# EAGLE schematic AS3364 waveform VCA 0402 DIL w two separate vcas v1.0 (EAGLE 9.6.2)
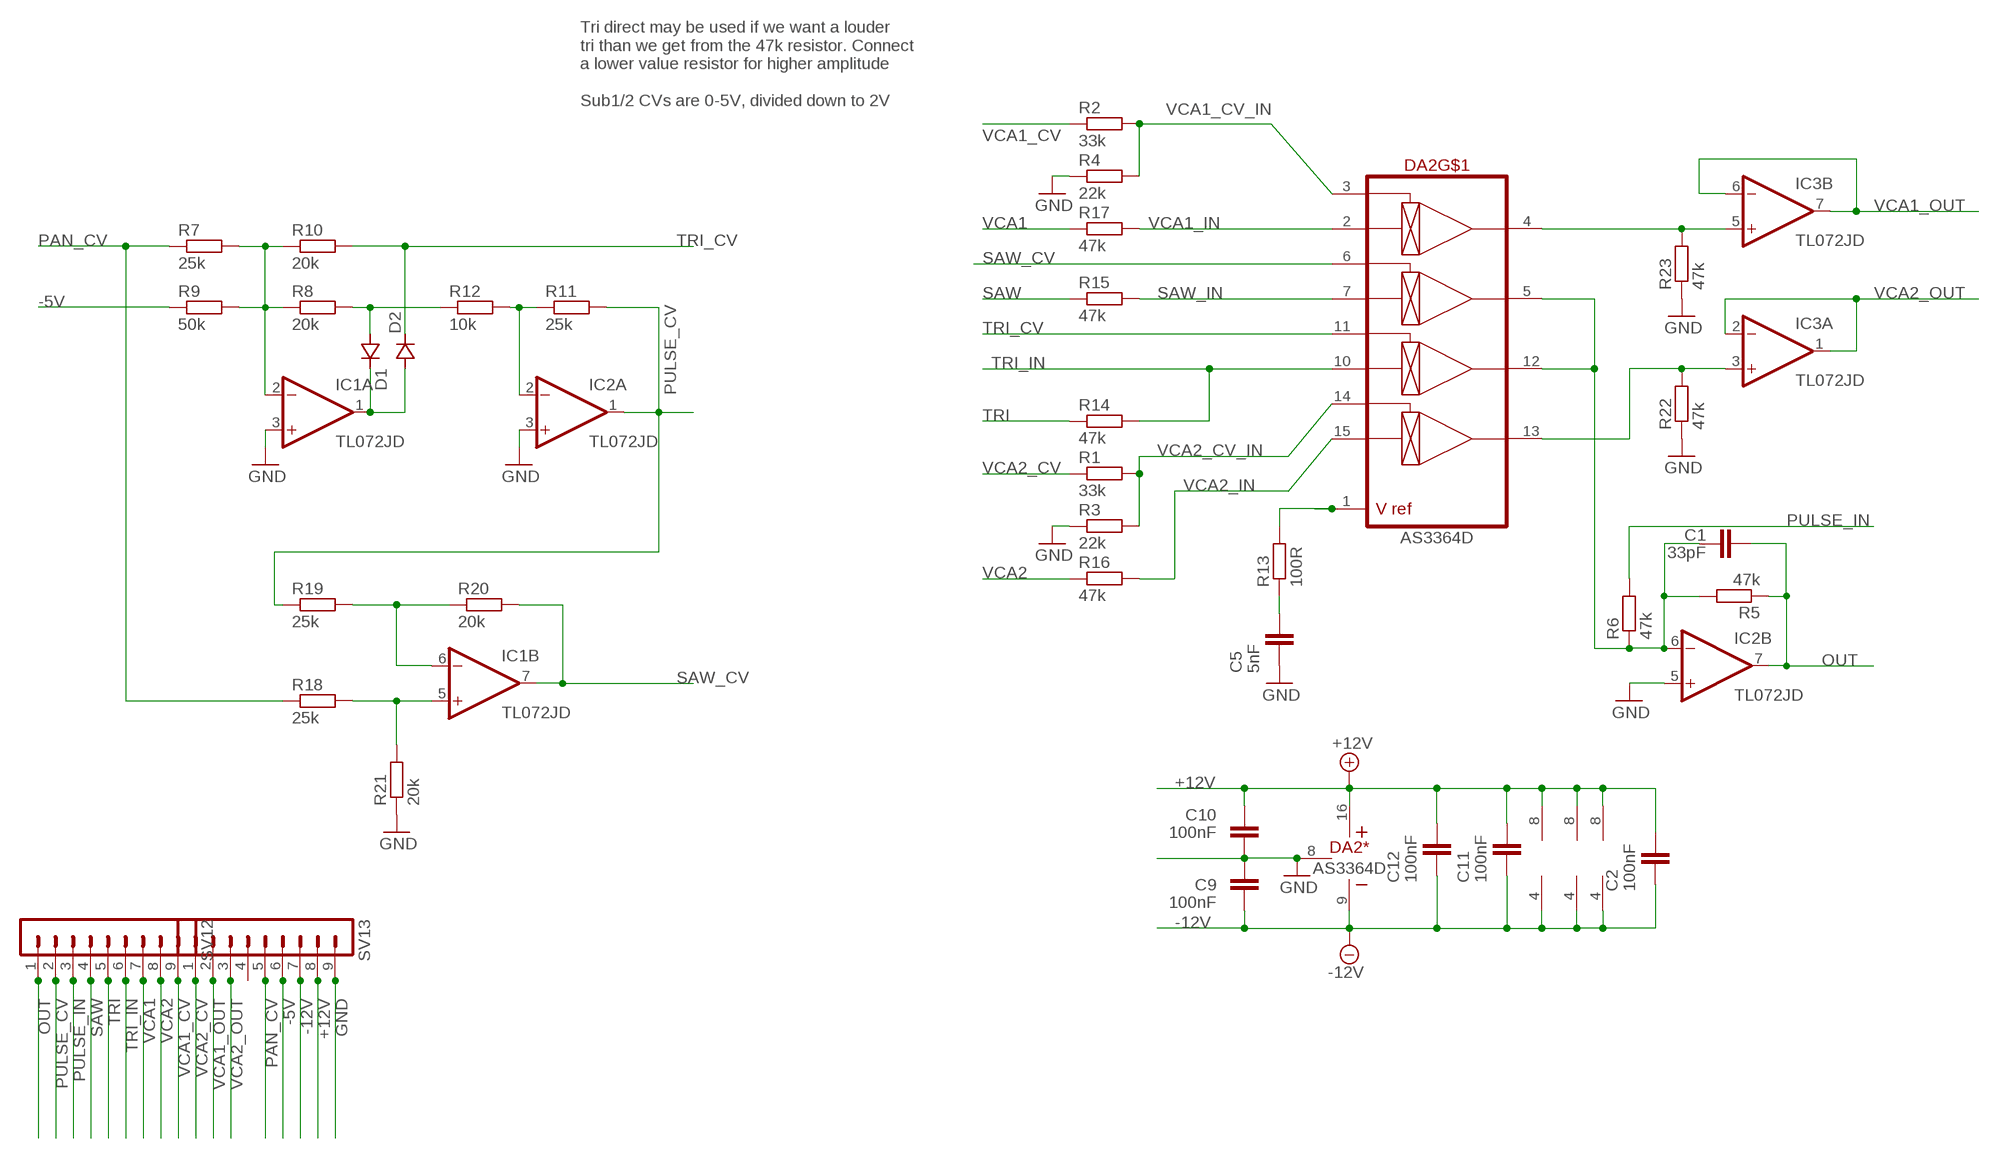
[diagram p0: schematic, sheet 1]

## Parts
C1  33pF  C-EUC0402  [C0402]
C2  100nF  C-EUC0402  [C0402]
C5  5nF  C-EUC0402  [C0402]
C9  100nF  C-EUC0402  [C0402]
C10  100nF  C-EUC0402  [C0402]
C11  100nF  C-EUC0402  [C0402]
C12  100nF  C-EUC0402  [C0402]
D1  DIODESOD323  [SOD323J]
D2  DIODESOD323  [SOD323J]
DA2  AS3364D  [DIL16J]
IC1  TL072JD  [SO08J]
IC2  TL072JD  [SO08J]
IC3  TL072JD  [SO08J]
R1  33k  R-EU_R0402  [R0402]
R2  33k  R-EU_R0402  [R0402]
R3  22k  R-EU_R0402  [R0402]
R4  22k  R-EU_R0402  [R0402]
R5  47k  R-EU_R0402  [R0402]
R6  47k  R-EU_R0402  [R0402]
R7  25k  R-EU_R0402  [R0402]
R8  20k  R-EU_R0402  [R0402]
R9  50k  R-EU_R0402  [R0402]
R10  20k  R-EU_R0402  [R0402]
R11  25k  R-EU_R0402  [R0402]
R12  10k  R-EU_R0402  [R0402]
R13  100R  R-EU_R0402  [R0402]
R14  47k  R-EU_R0402  [R0402]
R15  47k  R-EU_R0402  [R0402]
R16  47k  R-EU_R0402  [R0402]
R17  47k  R-EU_R0402  [R0402]
R18  25k  R-EU_R0402  [R0402]
R19  25k  R-EU_R0402  [R0402]
R20  20k  R-EU_R0402  [R0402]
R21  20k  R-EU_R0402  [R0402]
R22  47k  R-EU_R0402  [R0402]
R23  47k  R-EU_R0402  [R0402]
SV12  MA09-1JP  [SIP-PIN09-1J]
SV13  MA09-1JP  [SIP-PIN09-1J]

## Nets
+12V: C2.2 C10.2 C11.2 C12.2 DA2.16(*:V+) IC1.8(P:V+) IC2.8(P:V+) IC3.8(P:V+) SV13.8
-5V: R9.1 SV13.6
-12V: C2.1 C9.1 C11.1 C12.1 DA2.9(*:V-) IC1.4(P:V-) IC2.4(P:V-) IC3.4(P:V-) SV13.7
GND: C5.1 C9.2 C10.1 DA2.8(*:GND) IC1.3(A:+IN) IC2.3(A:+IN) IC2.5(B:+IN) R3.1 R4.1 R21.1 R22.1 R23.1 SV13.9
MIX_BUS: C1.2 DA2.5(OUT2) DA2.12(OUT3) IC2.6(B:-IN) R5.2 R6.1
N$2: DA2.1(VREF) R13.2
N$3: DA2.4(OUT1) IC3.5(B:+IN) R23.2
N$6: D1.1(C) D2.2(A) IC1.1(A:OUT)
N$7: DA2.13(OUT4) IC3.3(A:+IN) R22.2
N$8: IC1.2(A:-IN) R7.2 R8.1 R9.2 R10.1
N$11: IC1.5(B:+IN) R18.2 R21.2
N$14: C5.2 R13.1
N$15: IC1.6(B:-IN) R19.2 R20.1
N$18: IC2.2(A:-IN) R11.1 R12.2
N$19: D1.2(A) R8.2 R12.1
OUT: C1.1 IC2.7(B:OUT) R5.1 SV12.1
PAN_CV: R7.1 R18.1 SV13.5
PULSE_CV: IC2.1(A:OUT) R11.2 R19.1 SV12.2
PULSE_IN: R6.2 SV12.3
SAW: R15.1 SV12.4
SAW_CV: DA2.6(CV2) IC1.7(B:OUT) R20.2
SAW_IN: DA2.7(IN2) R15.2
TRI: R14.1 SV12.5
TRI_CV: D2.1(C) DA2.11(CV3) R10.2
TRI_IN: DA2.10(IN3) R14.2 SV12.6
VCA1: R17.1 SV12.7
VCA1_CV: R2.1 SV12.9
VCA1_CV_IN: DA2.3(CV1) R2.2 R4.2
VCA1_IN: DA2.2(IN1) R17.2
VCA1_OUT: IC3.6(B:-IN) IC3.7(B:OUT) SV13.2
VCA2: R16.1 SV12.8
VCA2_CV: R1.1 SV13.1
VCA2_CV_IN: DA2.14(CV4) R1.2 R3.2
VCA2_IN: DA2.15(IN4) R16.2
VCA2_OUT: IC3.1(A:OUT) IC3.2(A:-IN) SV13.3
Unconnected: SV13.4

## Notes on the sheet
- Tri direct may be used if we want a louder 
  tri than we get from the 47k resistor. Connect
  a lower value resistor for higher amplitude
  
  Sub1/2 CVs are 0-5V, divided down to 2V

## Library data of the parts
C1 C2 C5 C9-C12 = rcl:C-EU: CAPACITOR, European symbol; SPICEPREFIX: C
D1 D2 = joakim:DIODE: DIODE; MPN: CDSOD323-T05C; OC_FARNELL: 1824860; OC_NEWARK: 79R6078
DA2 = joakim:AS3364: AS3364 quad linear VCA, CEM3360 style. CV is 0 to 2V Vcc-Vee = 26V max, so +/-12V or +15V/-9V
IC1-IC3 = joakim:TL072J: OP AMP
R1-R23 = rcl:R-EU_: RESISTOR, European symbol; SPICEPREFIX: R
SV12 SV13 = joakim:MA09-1J: PIN HEADER